# Altium schematic sheet TopLevelDesign.SchDoc
size B; SheetNumber: 1; SheetTotal: 4
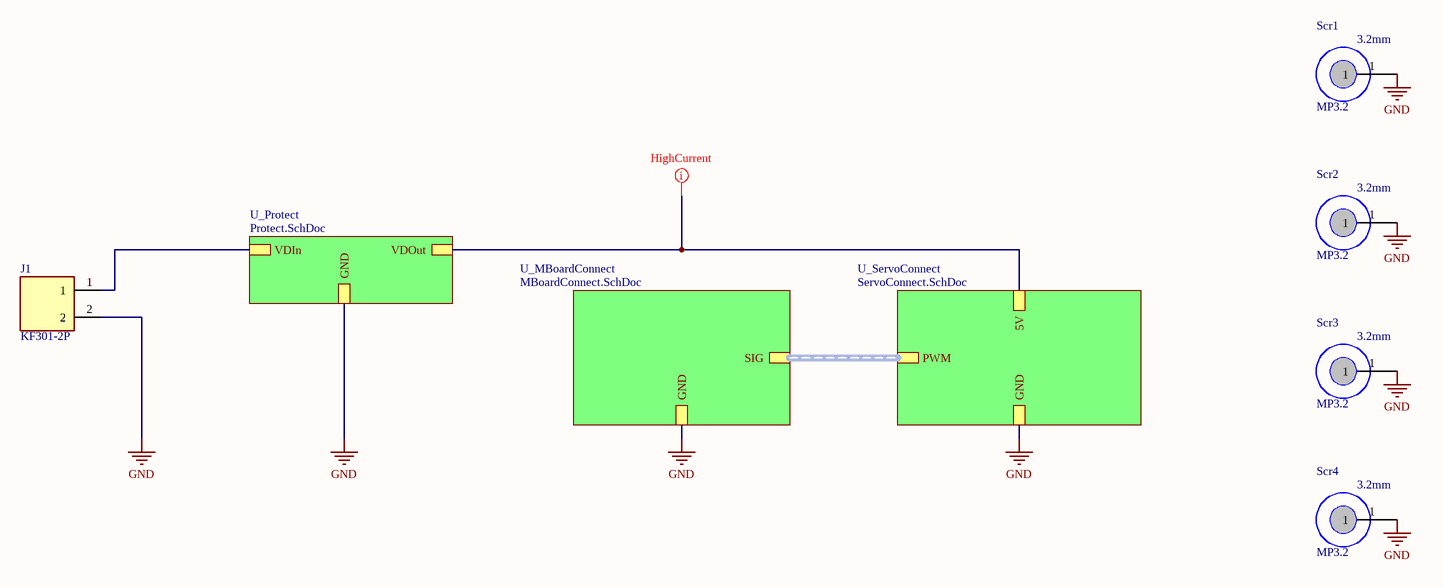
[diagram p0: TopLevelDesign.SchDoc]

## Parts
J1  KF301-2P  [HANDSON_KF301-2P]
Scr1  MP3.2  [MP3.2]
Scr2  MP3.2  [MP3.2]
Scr3  MP3.2  [MP3.2]
Scr4  MP3.2  [MP3.2]

## Sub-sheets
U_MBoardConnect = MBoardConnect.SchDoc: SIG (harness ServoConnector), GND
U_Protect = Protect.SchDoc: VDIn, GND, VDOut
U_ServoConnect = ServoConnect.SchDoc: 5V, GND, PWM (harness ServoConnector)

## Nets
GND: J1.2 Scr1.1 Scr2.1 Scr3.1 Scr4.1 ; sheet U_MBoardConnect/GND, sheet U_ServoConnect/GND, sheet U_Protect/GND
NetJ1_1: J1.1 ; sheet U_Protect/VDIn
(unnamed): sheet U_ServoConnect/5V, sheet U_Protect/VDOut

## Buses and harness runs
harness sheet U_MBoardConnect/SIG = sheet U_ServoConnect/PWM

## Layout directives
rule Width Constraint [Pref Width = 50mil    Min Width = 50mil    Max Width = 100mil]: (no net found under the mark)

## Notes on the sheet
- (in symbol CMP-143-000000-1) 3.2mm

## Library data of the parts
J1 = CMP-118-000001-1: 2 Pin Terminal Block 5mm Pitch; MP: KF301-2P; Design Item ID: KF301-2P; Value: *; Price: None; Package: None; Availability: Unavailable; Source: KF301-2P.SchLib
Scr1-Scr4 = CMP-143-000000-1: Component Type: Standard; Pin Count: 1; Source: MP_3P2.SchLib; Design Item ID: MP3.2